# Altium schematic sheet [6] RK3399_USB2_USIC.SchDoc: RK3399, USB2 and USIC
size B; DocumentNumber: I; Revision: 01; SheetNumber: 6; SheetTotal: 19
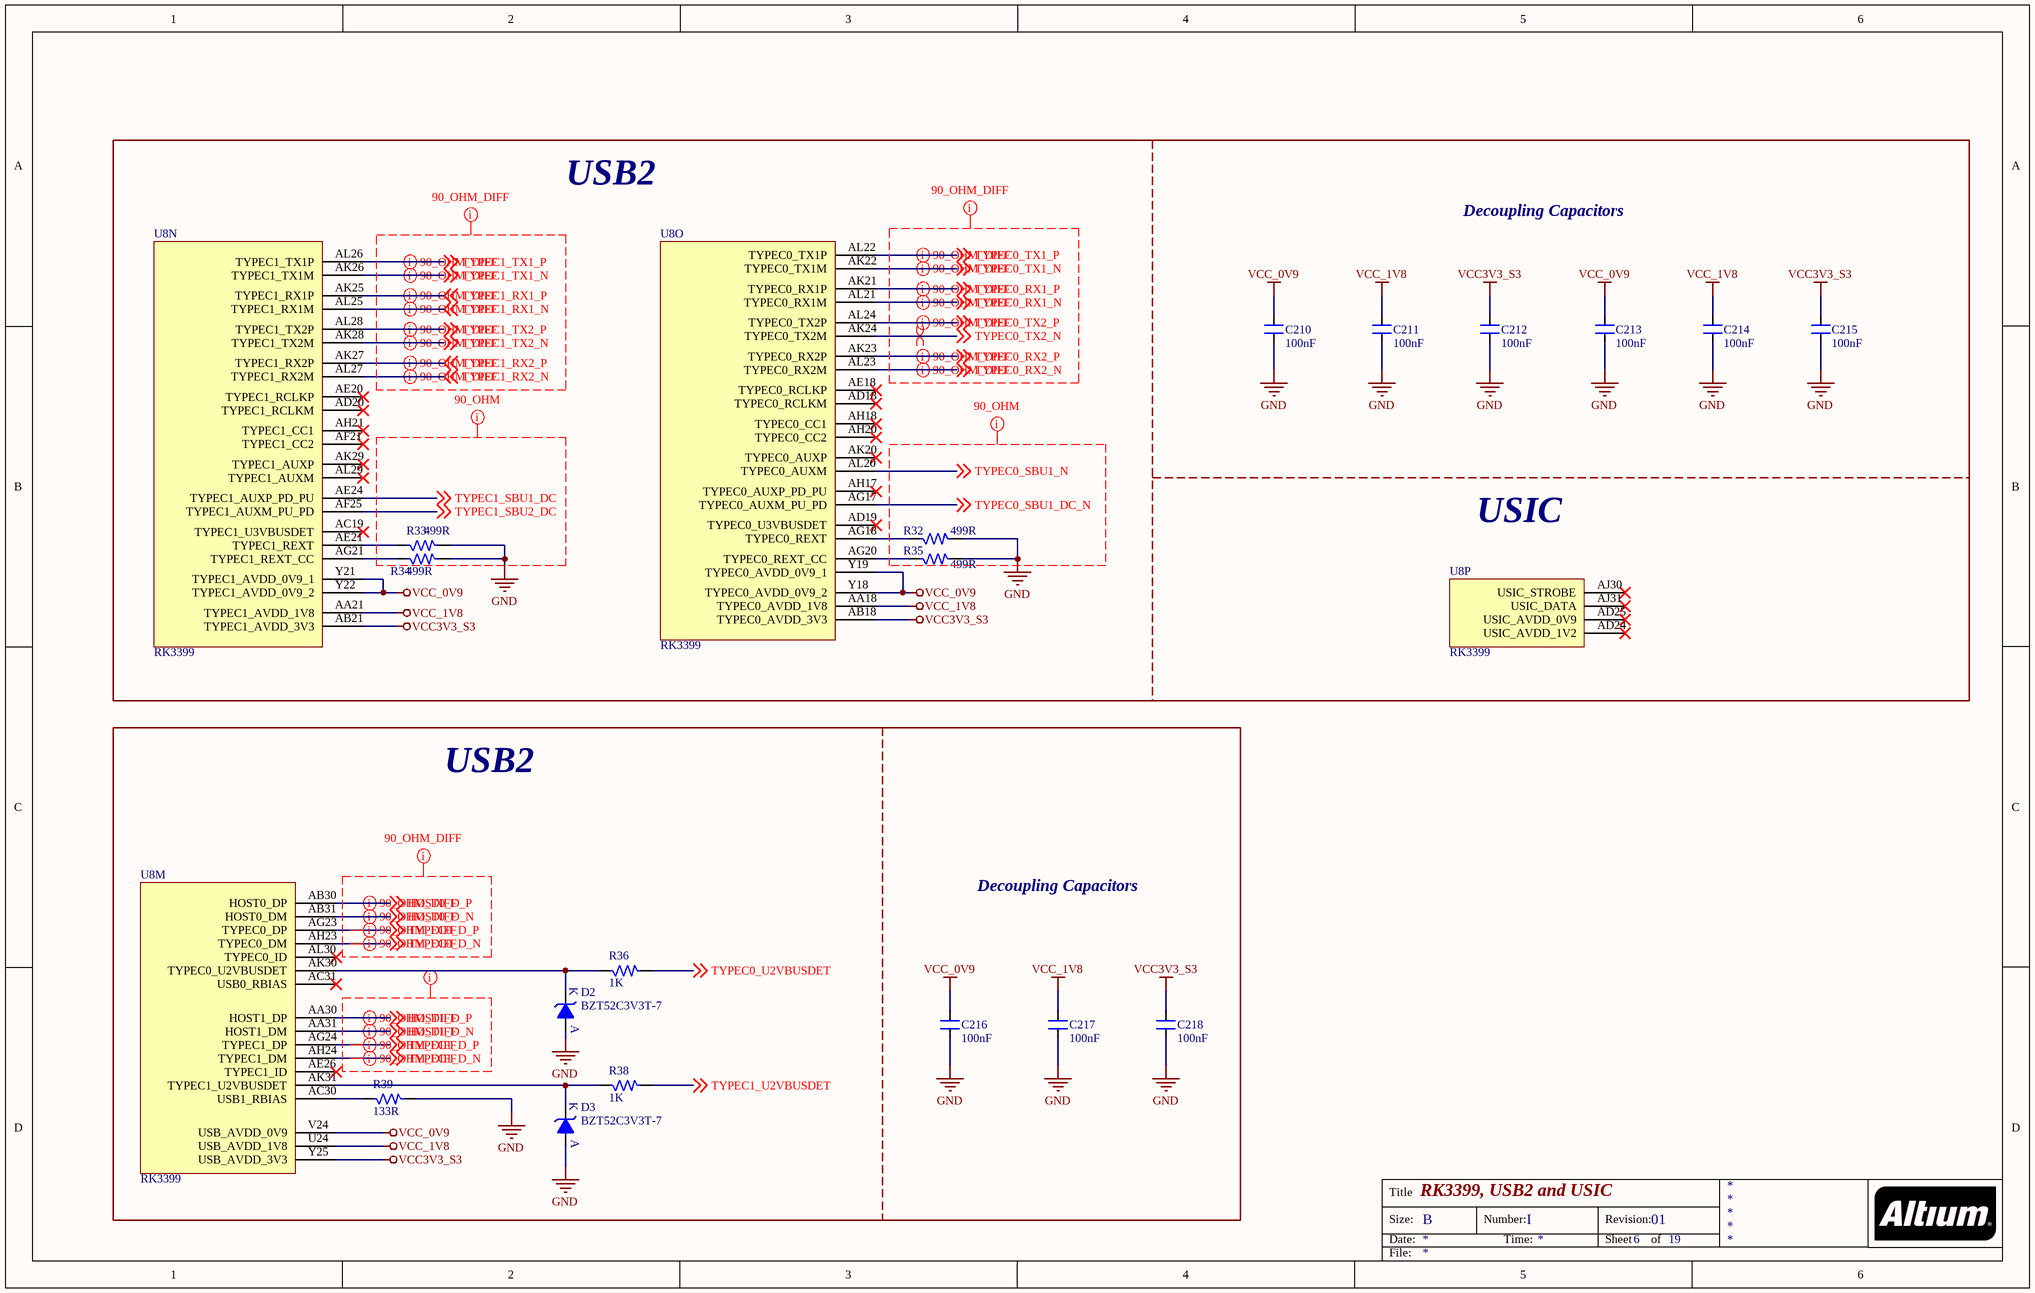
[diagram p0: [6] RK3399_USB2_USIC.SchDoc]

## Parts
C210  100nF  [CAP_0201]
C211  100nF  [CAP_0201]
C212  100nF  [CAP_0201]
C213  100nF  [CAP_0201]
C214  100nF  [CAP_0201]
C215  100nF  [CAP_0201]
C216  100nF  [CAP_0201]
C217  100nF  [CAP_0201]
C218  100nF  [CAP_0201]
D2  BZT52C3V3T-7  [DIO_SOD523]
D3  BZT52C3V3T-7  [DIO_SOD523]
R32  499R  [RES_0201]
R33  499R  [RES_0201]
R34  499R  [RES_0201]
R35  499R  [RES_0201]
R36  1K  [RES_0201]
R38  1K  [RES_0201]
R39  133R  [RES_0201]
U8  RK3399  [FBGA828_23_826X826]  (parts M,N,O,P of 24)

## Blocks framed on the sheet
USB2: C216-C218 D2 D3 R36 R38 R39 U8

## Nets
GND: C210.1 C211.1 C212.1 C213.1 C214.1 C215.1 C216.1 C217.1 C218.1 D2.A D3.A R32.2 R33.2 R34.2 R35.2 R39.2
VCC3V3_S3: C212.2 C215.2 C218.2 U8.AB18(TYPEC0_AVDD_3V3) U8.AB21(TYPEC1_AVDD_3V3) U8.Y25(USB_AVDD_3V3)
VCC_0V9: C210.2 C213.2 C216.2 U8.V24(USB_AVDD_0V9) U8.Y18(TYPEC0_AVDD_0V9_2) U8.Y19(TYPEC0_AVDD_0V9_1) U8.Y21(TYPEC1_AVDD_0V9_1) U8.Y22(TYPEC1_AVDD_0V9_2)
VCC_1V8: C211.2 C214.2 C217.2 U8.AA18(TYPEC0_AVDD_1V8) U8.AA21(TYPEC1_AVDD_1V8) U8.U24(USB_AVDD_1V8)
HOST0_D_N: U8.AB31(HOST0_DM) ; off-sheet HOST0_D_N
HOST0_D_P: U8.AB30(HOST0_DP) ; off-sheet HOST0_D_P
HOST1_D_N: U8.AA31(HOST1_DM) ; off-sheet HOST1_D_N
HOST1_D_P: U8.AA30(HOST1_DP) ; off-sheet HOST1_D_P
TYPEC0_D_N: U8.AH23(TYPEC0_DM) ; off-sheet TYPEC0_D_N
TYPEC0_D_P: U8.AG23(TYPEC0_DP) ; off-sheet TYPEC0_D_P
TYPEC0_RX1_N: U8.AL21(TYPEC0_RX1M) ; off-sheet TYPEC0_RX1_N
TYPEC0_RX1_P: U8.AK21(TYPEC0_RX1P) ; off-sheet TYPEC0_RX1_P
TYPEC0_RX2_N: U8.AL23(TYPEC0_RX2M) ; off-sheet TYPEC0_RX2_N
TYPEC0_RX2_P: U8.AK23(TYPEC0_RX2P) ; off-sheet TYPEC0_RX2_P
TYPEC0_SBU1_DC_N: U8.AG17(TYPEC0_AUXM_PU_PD) ; off-sheet TYPEC0_SBU1_DC_N
TYPEC0_SBU1_N: U8.AL20(TYPEC0_AUXM) ; off-sheet TYPEC0_SBU1_N
TYPEC0_TX1_N: U8.AK22(TYPEC0_TX1M) ; off-sheet TYPEC0_TX1_N
TYPEC0_TX1_P: U8.AL22(TYPEC0_TX1P) ; off-sheet TYPEC0_TX1_P
TYPEC0_TX2_N: U8.AK24(TYPEC0_TX2M) ; off-sheet TYPEC0_TX2_N
TYPEC0_TX2_P: U8.AL24(TYPEC0_TX2P) ; off-sheet TYPEC0_TX2_P
TYPEC0_U2VBUSDET: R36.2 ; off-sheet TYPEC0_U2VBUSDET
TYPEC1_D_N: U8.AH24(TYPEC1_DM) ; off-sheet TYPEC1_D_N
TYPEC1_D_P: U8.AG24(TYPEC1_DP) ; off-sheet TYPEC1_D_P
TYPEC1_RX1_N: U8.AL25(TYPEC1_RX1M) ; off-sheet TYPEC1_RX1_N
TYPEC1_RX1_P: U8.AK25(TYPEC1_RX1P) ; off-sheet TYPEC1_RX1_P
TYPEC1_RX2_N: U8.AL27(TYPEC1_RX2M) ; off-sheet TYPEC1_RX2_N
TYPEC1_RX2_P: U8.AK27(TYPEC1_RX2P) ; off-sheet TYPEC1_RX2_P
TYPEC1_SBU1_DC: U8.AE24(TYPEC1_AUXP_PD_PU) ; off-sheet TYPEC1_SBU1_DC
TYPEC1_SBU2_DC: U8.AF25(TYPEC1_AUXM_PU_PD) ; off-sheet TYPEC1_SBU2_DC
TYPEC1_TX1_N: U8.AK26(TYPEC1_TX1M) ; off-sheet TYPEC1_TX1_N
TYPEC1_TX1_P: U8.AL26(TYPEC1_TX1P) ; off-sheet TYPEC1_TX1_P
TYPEC1_TX2_N: U8.AK28(TYPEC1_TX2M) ; off-sheet TYPEC1_TX2_N
TYPEC1_TX2_P: U8.AL28(TYPEC1_TX2P) ; off-sheet TYPEC1_TX2_P
TYPEC1_U2VBUSDET: R38.2 ; off-sheet TYPEC1_U2VBUSDET
NetD2_K: D2.K R36.1 U8.AK30(TYPEC0_U2VBUSDET)
NetD3_K: D3.K R38.1 U8.AK31(TYPEC1_U2VBUSDET)
NetR32_1: R32.1 U8.AG18(TYPEC0_REXT)
NetR33_1: R33.1 U8.AE21(TYPEC1_REXT)
NetR34_1: R34.1 U8.AG21(TYPEC1_REXT_CC)
NetR35_1: R35.1 U8.AG20(TYPEC0_REXT_CC)
NetR39_1: R39.1 U8.AC30(USB1_RBIAS)

Not connected (* = marked no-connect by the designer): U8 AC19(TYPEC1_U3VBUSDET)* AC31(USB0_RBIAS)* AD18(TYPEC0_RCLKM)* AD19(TYPEC0_U3VBUSDET)* AD20(TYPEC1_RCLKM)* AD24(USIC_AVDD_1V2)* AD25(USIC_AVDD_0V9)* AE18(TYPEC0_RCLKP)* AE20(TYPEC1_RCLKP)* AE26(TYPEC1_ID)* AF21(TYPEC1_CC2)* AH17(TYPEC0_AUXP_PD_PU)* AH18(TYPEC0_CC1)* AH20(TYPEC0_CC2)* AH21(TYPEC1_CC1)* AJ30(USIC_STROBE)* AJ31(USIC_DATA)* AK20(TYPEC0_AUXP)* AK29(TYPEC1_AUXP)* AL29(TYPEC1_AUXM)* AL30(TYPEC0_ID)*

## Layout directives
differential pair; differential pair class 90_OHM_DIFF: HOST0_D_N, HOST0_D_P, HOST1_D_N, HOST1_D_P, TYPEC0_D_N, TYPEC0_D_P, TYPEC0_RX1_N, TYPEC0_RX1_P, TYPEC0_RX2_N, TYPEC0_RX2_P, TYPEC0_TX1_N, TYPEC0_TX1_P, TYPEC0_TX2_N, TYPEC0_TX2_P, TYPEC1_D_N, TYPEC1_D_P, TYPEC1_RX1_N, TYPEC1_RX1_P, TYPEC1_RX2_N, TYPEC1_RX2_P, TYPEC1_TX1_N, TYPEC1_TX1_P, TYPEC1_TX2_N, TYPEC1_TX2_P
mark named 90_OHM_DIFF: HOST0_D_N, HOST0_D_P, HOST1_D_N, HOST1_D_P, TYPEC0_D_N, TYPEC0_D_P, TYPEC0_RX1_N, TYPEC0_RX1_P, TYPEC0_RX2_N, TYPEC0_RX2_P, TYPEC0_TX1_N, TYPEC0_TX1_P, TYPEC0_TX2_N, TYPEC0_TX2_P, TYPEC1_D_N, TYPEC1_D_P, TYPEC1_RX1_N, TYPEC1_RX1_P, TYPEC1_RX2_N, TYPEC1_RX2_P, TYPEC1_TX1_N, TYPEC1_TX1_P, TYPEC1_TX2_N, TYPEC1_TX2_P
net class 90_OHM: GND, TYPEC0_SBU1_DC_N, TYPEC0_SBU1_N, TYPEC1_SBU1_DC, TYPEC1_SBU2_DC

## Notes on the sheet
- USB2
- Decoupling Capacitors
- USIC
- Title
- Size:
- Date:
- B
- Number:
- Time:
- Revision:
- Sheet
- of
- File:

## Library data of the parts
C210-C218 = CAP_100nF-25V-10%-0201: 0.1µF ±10% 25V Ceramic Capacitor X5R 0201 (0603 Metric) /; Manufacturer: TDK Corporation; Manufacturer Part Number: C0603X5R1E104K030BB; Case/Package: 0201; Supplier-1: Digikey
D2 D3 = DIO-Z_3.3V-300mW-SOD-523: Zener Diode 3.3V 300mW ±6% Surface Mount SOD-523 /; Manufacturer: Diodes Incorporated; Manufacturer Part Number: BZT52C3V3T-7; Case/Package: SOD523; Supplier-1: Digikey
R32-R35 = RES_499R-0.05W-1%-0201: 499 Ohms ±1% 0.05W, 1/20W Chip Resistor 0201 (0603 Metric) Thick Film /; Manufacturer: Stackpole Electronics Inc; Manufacturer Part Number: RMCF0201FT499R; Case/Package: 0201; Supplier-1: Digikey
R36 R38 = RES_1K-0.05W-1%-0201: 1 kOhms ±1% 0.05W, 1/20W Chip Resistor 0201 (0603 Metric) Thick Film /; Manufacturer: Yageo; Manufacturer Part Number: RC0201FR-071KL; Case/Package: 0201; Supplier-1: Digikey
R39 = RES_133R-0.05W-1%-0201: 133 Ohms ±1% 0.05W, 1/20W Chip Resistor 0201 (0603 Metric) Automotive AEC-Q200 Thick Film /; Manufacturer: Panasonic Electronic Components; Manufacturer Part Number: ERJ-1GNF1330C; Case/Package: 0201; Supplier-1: Digikey
U8 = IC_RK3399-FCBGA828: RK3399 is a low power, high performance processor for computing, personal mobile.; Manufacturer: Rockchip; Manufacturer Part Number: RK3399; Case/Package: FCBGA828; Supplier-1: Rockchip